# Altium schematic sheet Motor Control.SchDoc
size A3; SheetNumber: 0; SheetTotal: 0
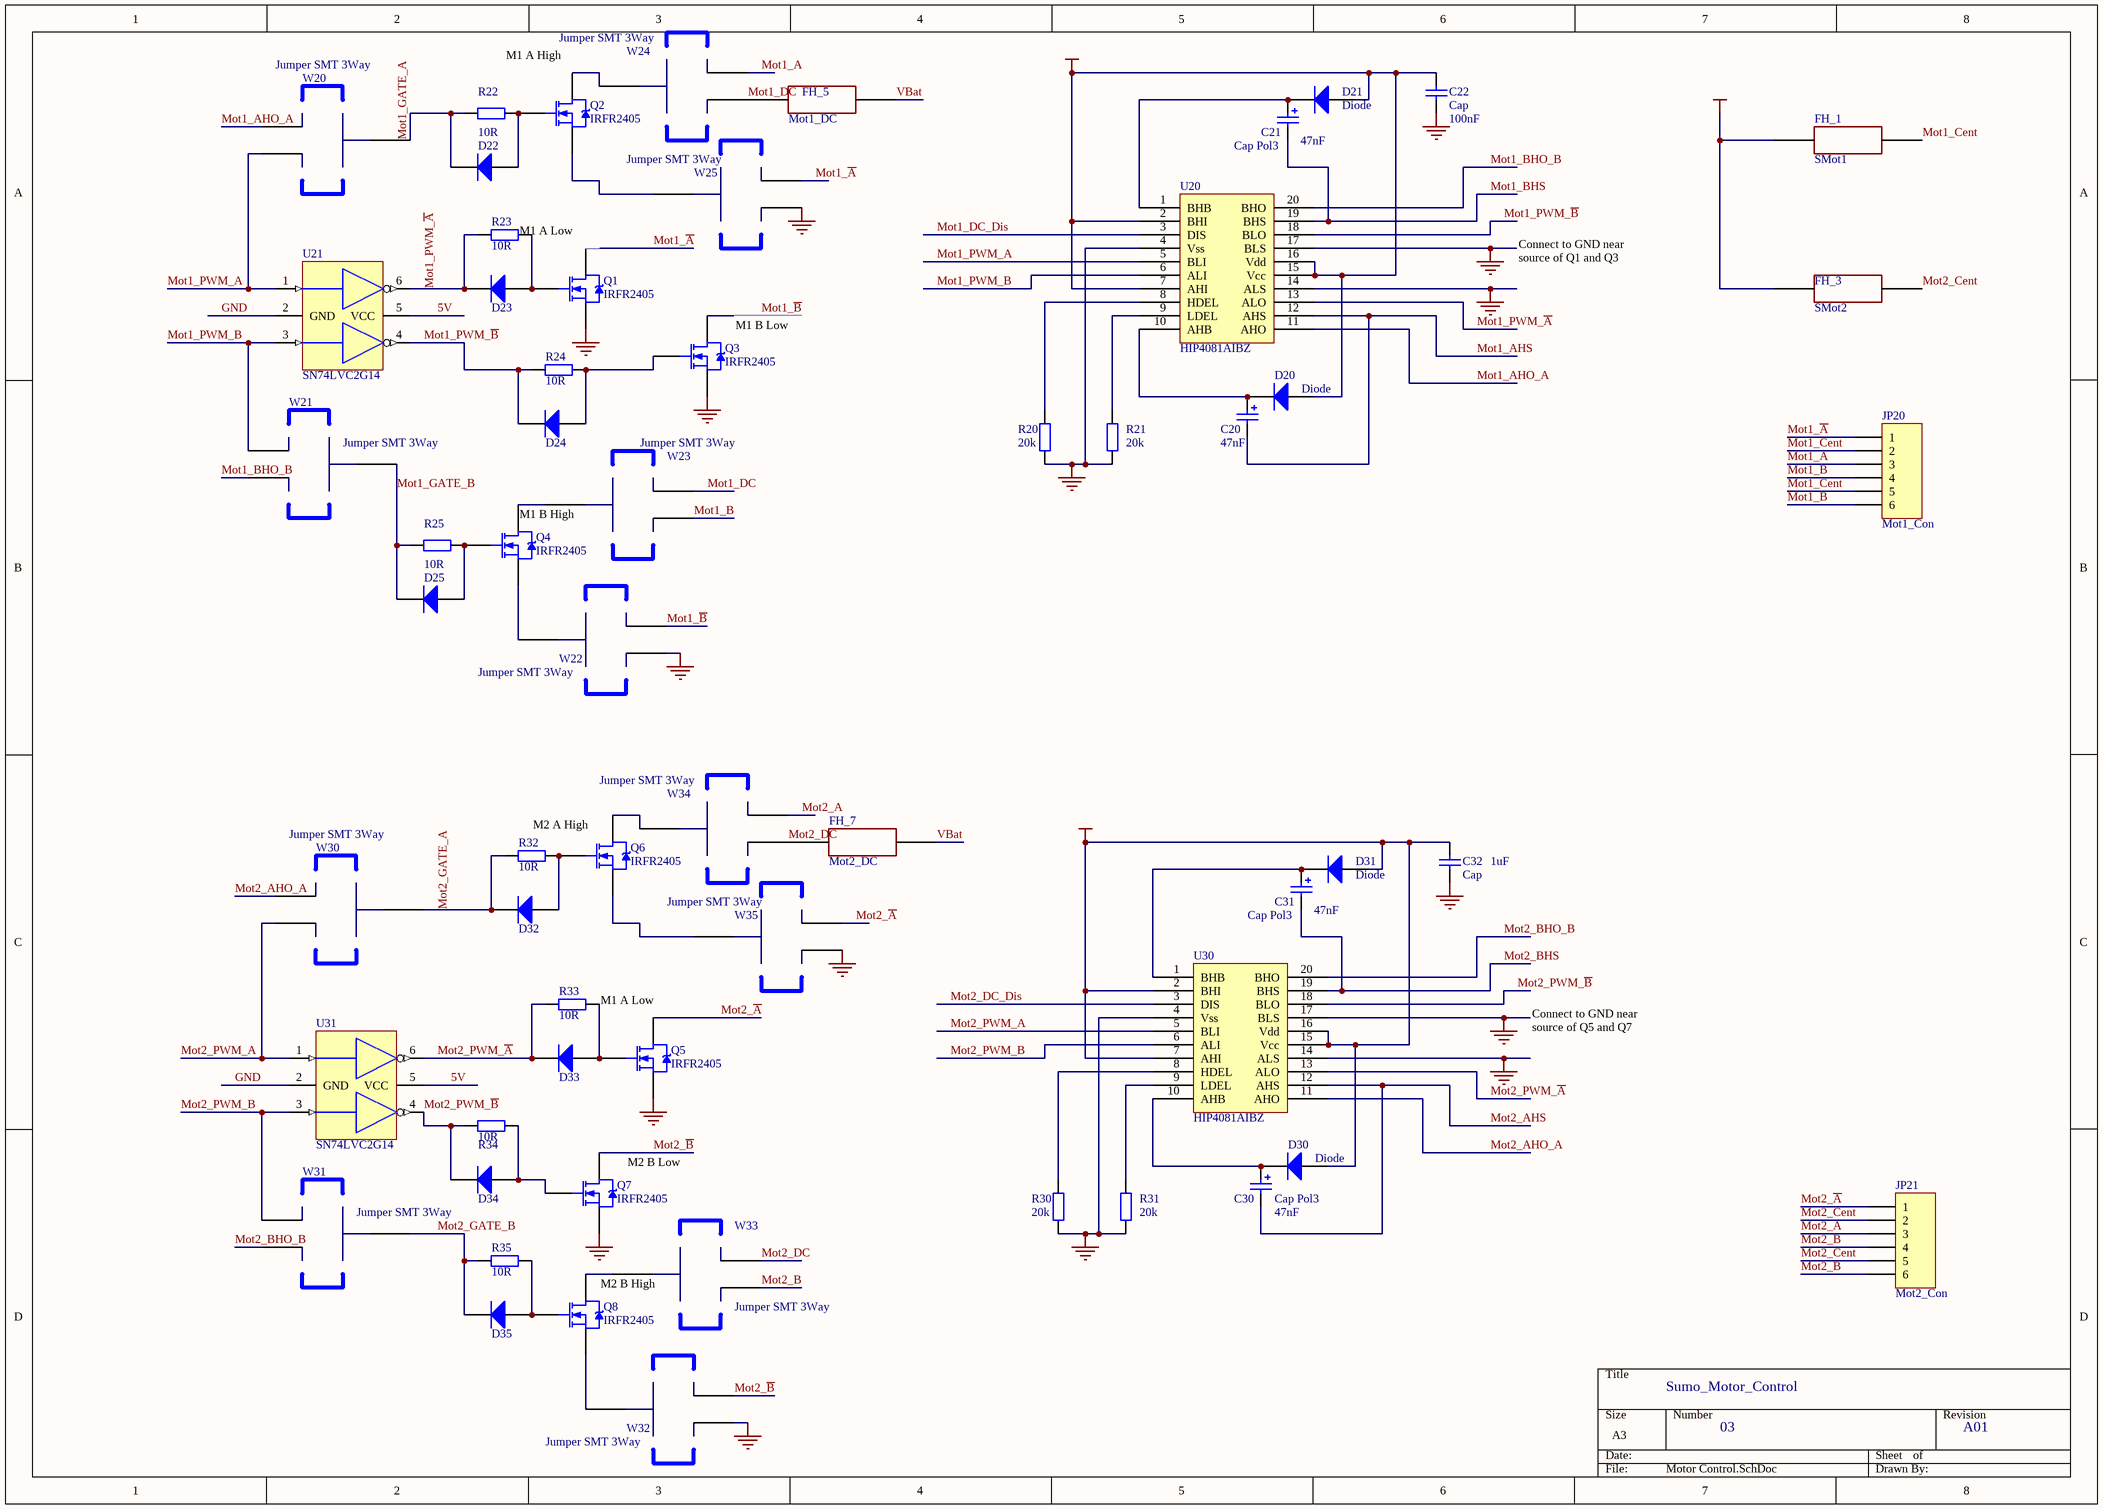
[diagram p0: Motor Control.SchDoc]

## Parts
C20  value 47nF  [CC2012-0805]  (hidden comment: Cap Pol3)
C21  Cap Pol3  value 47nF  [CC2012-0805]
C22  Cap  value 100nF  [CC2012-0805]
C30  Cap Pol3  value 47nF  [CC2012-0805]
C31  Cap Pol3  value 47nF  [CC2012-0805]
C32  Cap  value 1uF  [CC2012-0805]
D20  Diode  [SMA]
D21  Diode  [SMA]
D22  Diode  [SMA]  (value not drawn)
D23  Diode  [SMA]  (value not drawn)
D24  Diode  [SMA]  (value not drawn)
D25  Diode  [SMA]  (value not drawn)
D30  Diode  [SMA]
D31  Diode  [SMA]
D32  Diode  [SMA]  (value not drawn)
D33  Diode  [SMA]  (value not drawn)
D34  Diode  [SMA]  (value not drawn)
D35  Diode  [SMA]  (value not drawn)
FH_1  SMot1  [FuseHolder Miniblade]
FH_3  SMot2  [FuseHolder Miniblade]
FH_5  Mot1_DC  [FuseHolder Miniblade]
FH_7  Mot2_DC  [FuseHolder Miniblade]
JP20  Mot1_Con  [microfit 2x3 3mm]
JP21  Mot2_Con  [microfit 2x3 3mm]
Q1  IRFR2405  [TO-252AA]
Q2  IRFR2405  [TO-252AA]
Q3  IRFR2405  [TO-252AA]
Q4  IRFR2405  [TO-252AA]
Q5  IRFR2405  [TO-252AA]
Q6  IRFR2405  [TO-252AA]
Q7  IRFR2405  [TO-252AA]
Q8  IRFR2405  [TO-252AA]
R20  value 20k  [CR2012-0805]  (hidden comment: Res Semi)
R21  value 20k  [CR2012-0805]  (hidden comment: Res Semi)
R22  value 10R  [CR2012-0805]  (hidden comment: Res Semi)
R23  value 10R  [CR2012-0805]  (hidden comment: Res Semi)
R24  value 10R  [CR2012-0805]  (hidden comment: Res Semi)
R25  value 10R  [CR2012-0805]  (hidden comment: Res Semi)
R30  value 20k  [CR2012-0805]  (hidden comment: Res Semi)
R31  value 20k  [CR2012-0805]  (hidden comment: Res Semi)
R32  value 10R  [CR2012-0805]  (hidden comment: Res Semi)
R33  value 10R  [CR2012-0805]  (hidden comment: Res Semi)
R34  value 10R  [CR2012-0805]  (hidden comment: Res Semi)
R35  value 10R  [CR2012-0805]  (hidden comment: Res Semi)
U20  HIP4081AIBZ  [SOIC20A]
U21  SN74LVC2G14  [SC70]
U30  HIP4081AIBZ  [SOIC20A]
U31  SN74LVC2G14  [SC70]
W20  Jumper SMT 3Way  [Jumper SMT 3 Way]
W21  Jumper SMT 3Way  [Jumper SMT 3 Way]
W22  Jumper SMT 3Way  [Jumper SMT 3 Way]
W23  Jumper SMT 3Way  [Jumper SMT 3 Way]
W24  Jumper SMT 3Way  [Jumper SMT 3 Way]
W25  Jumper SMT 3Way  [Jumper SMT 3 Way]
W30  Jumper SMT 3Way  [Jumper SMT 3 Way]
W31  Jumper SMT 3Way  [Jumper SMT 3 Way]
W32  Jumper SMT 3Way  [Jumper SMT 3 Way]
W33  Jumper SMT 3Way  [Jumper SMT 3 Way]
W34  Jumper SMT 3Way  [Jumper SMT 3 Way]
W35  Jumper SMT 3Way  [Jumper SMT 3 Way]

## Nets
12V: C22.2 C32.2 D20.1(A) D21.1(A) D30.1(A) D31.1(A) U20.2(BHI) U20.7(AHI) U20.15(Vcc) U20.16(Vdd) U30.2(BHI) U30.7(AHI) U30.15(Vcc) U30.16(Vdd)
GND: C22.1 C32.1 Q1.3(S) Q3.3(S) Q5.3(S) Q7.3(S) R20.1 R21.1 R30.1 R31.1 U20.4(Vss) U20.14(ALS) U20.17(BLS) U21.2(GND) U30.4(Vss) U30.14(ALS) U30.17(BLS) U31.2(GND) W22.3(Out2) W25.3(Out2) W32.3(Out2) W35.3(Out2)
VBat: FH_1.1 FH_3.1 FH_5.2 FH_7.2
5V: U21.5(VCC) U31.5(VCC)
Mot1_A: JP20.3 W24.2(Out1)
Mot1_~{A}: JP20.1 Q1.4(D) W25.2(Out1)
Mot1_AHO_A: U20.11(AHO) W20.3(Out2)
Mot1_AHS: C20.2 U20.12(AHS)
Mot1_B: JP20.6 W23.3(Out2)
Mot1_~{B}: JP20.4 Q3.4(D) W22.2(Out1)
Mot1_BHO_B: U20.20(BHO) W21.2(Out1)
Mot1_BHS: C21.2 U20.19(BHS)
Mot1_Cent: FH_1.2 JP20.2 JP20.5
Mot1_DC: FH_5.1 W23.2(Out1) W24.3(Out2)
Mot1_DC_Dis: U20.3(DIS)
Mot1_GATE_A: D22.2(K) R22.1 W20.1(In)
Mot1_GATE_B: D25.2(K) R25.1 W21.1(In)
Mot1_PWM_A: U20.5(BLI) U21.1(A) W20.2(Out1)
Mot1_PWM_~{A}: D23.2(K) R23.1 U20.13(ALO) U21.6(Y)
Mot1_PWM_B: U20.6(ALI) U21.3(A) W21.3(Out2)
Mot1_PWM_~{B}: D24.2(K) R24.1 U20.18(BLO) U21.4(Y)
Mot2_A: JP21.3 W34.2(Out1)
Mot2_~{A}: JP21.1 Q5.4(D) W35.2(Out1)
Mot2_AHO_A: U30.11(AHO) W30.3(Out2)
Mot2_AHS: C30.2 U30.12(AHS)
Mot2_B: JP21.6 W33.3(Out2)
Mot2_~{B}: JP21.4 Q7.4(D) W32.2(Out1)
Mot2_BHO_B: U30.20(BHO) W31.2(Out1)
Mot2_BHS: C31.2 U30.19(BHS)
Mot2_Cent: FH_3.2 JP21.2 JP21.5
Mot2_DC: FH_7.1 W33.2(Out1) W34.3(Out2)
Mot2_DC_Dis: U30.3(DIS)
Mot2_GATE_A: D32.2(K) R32.1 W30.1(In)
Mot2_GATE_B: D35.2(K) R35.1 W31.1(In)
Mot2_PWM_A: U30.5(BLI) U31.1(A) W30.2(Out1)
Mot2_PWM_~{A}: D33.2(K) R33.1 U30.13(ALO) U31.6(Y)
Mot2_PWM_B: U30.6(ALI) U31.3(A) W31.3(Out2)
Mot2_PWM_~{B}: D34.2(K) R34.1 U30.18(BLO) U31.4(Y)
NetC20_1: C20.1 D20.2(K) U20.10(AHB)
NetC21_1: C21.1 D21.2(K) U20.1(BHB)
NetC30_1: C30.1 D30.2(K) U30.10(AHB)
NetC31_1: C31.1 D31.2(K) U30.1(BHB)
NetD22_1: D22.1(A) Q2.1(G) R22.2
NetD23_1: D23.1(A) Q1.1(G) R23.2
NetD24_1: D24.1(A) Q3.1(G) R24.2
NetD25_1: D25.1(A) Q4.1(G) R25.2
NetD32_1: D32.1(A) Q6.1(G) R32.2
NetD33_1: D33.1(A) Q5.1(G) R33.2
NetD34_1: D34.1(A) Q7.1(G) R34.2
NetD35_1: D35.1(A) Q8.1(G) R35.2
NetQ2_3: Q2.3(S) W25.1(In)
NetQ2_4: Q2.4(D) W24.1(In)
NetQ4_3: Q4.3(S) W22.1(In)
NetQ4_4: Q4.4(D) W23.1(In)
NetQ6_3: Q6.3(S) W35.1(In)
NetQ6_4: Q6.4(D) W34.1(In)
NetQ8_3: Q8.3(S) W32.1(In)
NetQ8_4: Q8.4(D) W33.1(In)
NetR20_2: R20.2 U20.8(HDEL)
NetR21_2: R21.2 U20.9(LDEL)
NetR30_2: R30.2 U30.8(HDEL)
NetR31_2: R31.2 U30.9(LDEL)

## Notes on the sheet
- M1 A High
- (near R23) M1 A Low
- Connect to GND near source of Q1 and Q3
- (near Q3) M1 B Low
- M1 B High
- (near Q6) M2 A High
- (near R33) M1 A Low
- Connect to GND near source of Q5 and Q7
- (near Q7) M2 B Low
- (near W33) M2 B High
- Sumo_Motor_Control
- 03
- A01

## Library data of the parts
C20 C21 C30 C31 = Cap Pol3: Polarized Capacitor (Surface Mount); Published: 8-Jun-2000; Revision: July-2002: Re-released for DXP Platform.; Publisher: Altium Limited
C22 C32 = Cap: Capacitor; Published: 8-Jun-2000; Revision: July-2002: Re-released for DXP Platform.; Publisher: Altium Limited
D20-D25 D30-D35 = Diode: Default Diode; Code - JEDEC: DO-214-AB; Published: 8-Jun-2000; Revision: July-2002: Re-released for DXP Platform.; Publisher: Altium Limited
FH_1 FH_3 FH_5 = Fuse_Holder: Fuse Holder
FH_7 = Fuse_Holder
JP20 JP21 = Header 6: Header, 6-Pin; Revision: 17-Jul-2002: Re-released for DXP Platform.; Publisher: Altium Limited
Q1-Q8 = IRFR2405: HEXFET Power MOSFET; Note: Pin 2 is trimmed and not drawn; Code - JEDEC: TO-252-AA; Published: 17-Sep-2003; Datasheet: Latest Revision: 1-Mar-2000; Package Reference: TO-252AA; Publisher: Altium Limited
R20-R25 R30-R35 = Res Semi: Semiconductor Resistor; Published: 8-Jun-2000; Revision: July-2002: Re-released for DXP Platform.; Publisher: Altium Limited
U20 U30 = HIP4081AIBZ: 80V/2.5A Peak, High Frequency Full Bridge FET Driver
U21 U31 = SN74LVC2G14: Dual Schmitt-Trigger Inverter; Package Information: Latest Revision: May-1999; Code - JEDEC: MO-203; Published: 8-Jun-2000; Revision: 17-Jul-2002: Re-released for DXP Platform.; Datasheet: Latest Revision: Jul-1995; Package Reference: DB014; Publisher: Altium Limited